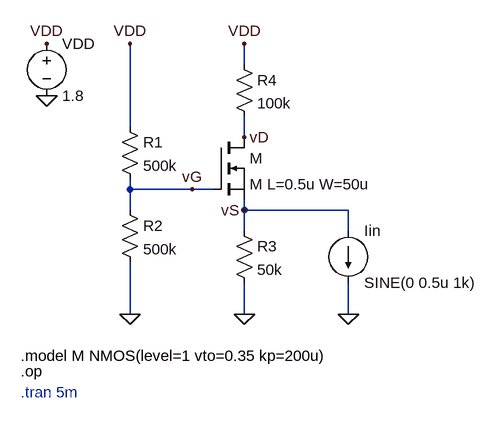
[diagram p0: schematic hw4_112021117_1d.asc]
hw4_112021117_1d.asc, the LTspice schematic file:
Version 4.1
SHEET 1 880 680
WIRE 240 48 240 16
WIRE 64 144 64 16
WIRE 240 160 240 128
WIRE 64 240 64 224
WIRE 160 240 64 240
WIRE 192 240 160 240
WIRE 64 272 64 240
WIRE 240 272 240 256
WIRE 400 272 240 272
WIRE 240 304 240 272
WIRE 400 304 400 272
WIRE 64 432 64 352
WIRE 240 432 240 384
WIRE 400 432 400 384
FLAG 64 432 0
FLAG -64 96 0
FLAG 64 16 VDD
FLAG 240 16 VDD
FLAG -64 16 VDD
FLAG 240 432 0
FLAG 400 432 0
FLAG 160 240 vG
FLAG 240 272 vS
FLAG 240 160 vD
SYMBOL res 48 128 R0
SYMATTR InstName R1
SYMATTR Value 500k
SYMBOL res 48 256 R0
SYMATTR InstName R2
SYMATTR Value 500k
SYMBOL nmos 192 160 R0
SYMATTR InstName M
SYMATTR Value M L=0.5u W=50u
SYMBOL res 224 32 R0
SYMATTR InstName R4
SYMATTR Value 100k
SYMBOL voltage -64 0 R0
SYMATTR InstName VDD
SYMATTR Value 1.8
SYMBOL res 224 288 R0
SYMATTR InstName R3
SYMATTR Value 50k
SYMBOL current 400 304 R0
WINDOW 123 0 0 Left 0
WINDOW 39 0 0 Left 0
SYMATTR InstName Iin
SYMATTR Value SINE(0 0.5u 1k)
TEXT -104 496 Left 2 !.model M NMOS(level=1 vto=0.35 kp=200u)
TEXT -104 520 Left 2 !.op
TEXT -104 552 Left 2 ;.tran 5m

The netlist it stands for:
* hw4_112021117_1d.asc
R1 VDD vG 500k
R2 vG 0 500k
M vD vG vS vS M L=0.5u W=50u
R4 VDD vD 100k
VDD VDD 0 1.8
R3 vS 0 50k
Iin vS 0 SINE(0 0.5u 1k)
.model NMOS NMOS
.model PMOS PMOS
.lib standard.mos
.model M NMOS(level=1 vto=0.35 kp=200u)
.op
* .tran 5m
.backanno
.end